# EAGLE design untitled (EAGLE 9.6.2)
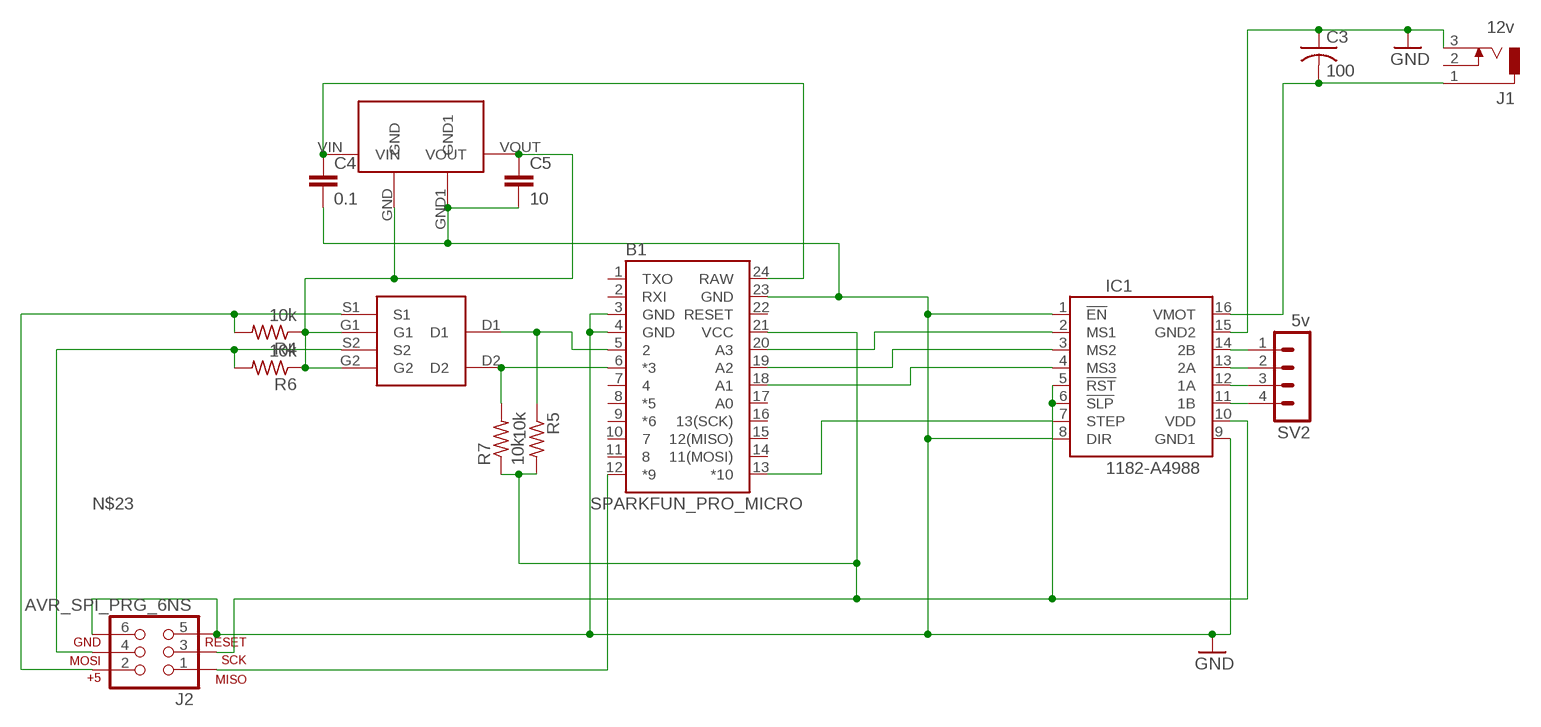
[diagram p0: schematic, sheet 1]

## Parts
B1  SPARKFUN_PRO_MICRO  [SPARKFUN_PRO_MICRO]
C3  100  C-US050-075X075  [C050-075X075]
C4  0.1  CAP0603-CAP  [0603-CAP]
C5  10  CAP0603-CAP  [0603-CAP]
IC1  1182-A4988  [A4988]
J1  12v  DCJ0303  [DCJ0303]
J2  AVR_SPI_PRG_6NS  [2X3-NS]
R4  10k  R-US_0207/10  [0207/10]
R5  10k  R-US_0207/10  [0207/10]
R6  10k  R-US_0207/10  [0207/10]
R7  10k  R-US_0207/10  [0207/10]
SV2  5v  MA04-1  [MA04-1]
U$2  LD1117  [SOT223]
U$3  BSS138  [SOT363]

## Nets
GND: B1.3(GND) B1.4(GND) B1.23(GND) C3.1 C4.2 C5.2 IC1.1(!EN) IC1.8(DIR) IC1.9(GND1) IC1.15(GND2) J1.3 J2.5 J2.6 U$2.GND1
N$1: IC1.14(2B) SV2.1
N$3: C5.1 R4.1 R6.1 U$2.GND U$2.VOUT U$3.G1 U$3.G2
N$4: IC1.13(2A) SV2.2
N$5: IC1.12(1A) SV2.3
N$6: IC1.11(1B) SV2.4
N$7: B1.20(A3) IC1.2(MS1)
N$8: B1.19(A2) IC1.3(MS2)
N$9: B1.18(A1) IC1.4(MS3)
N$10: B1.21(VCC) IC1.5(!RST) IC1.6(!SLP) IC1.10(VDD) J2.3 R5.2 R7.1
N$12: C3.2 IC1.16(VMOT) J1.1
N$13: B1.13(*10) IC1.7(STEP)
N$15: B1.24(RAW) C4.1 U$2.VIN
N$18: B1.12(*9) J2.1
N$19: B1.5 R5.1 U$3.D1
N$21: B1.6(*3) R7.2 U$3.D2
N$22: J2.2 R4.2 U$3.S1
N$23: J2.4 R6.2 U$3.S2
Unconnected: B1.1(TXO) B1.2(RXI) B1.7 B1.8(*5) B1.9(*6) B1.10 B1.11 B1.14(11(MOSI)) B1.15(12(MISO)) B1.16(13(SCK)) B1.17(A0) B1.22(RESET) J1.2

## Library data of the parts
B1 = SparkFun-Boards:SPARKFUN_PRO_MICRO: SparkFun Pro Micro Atmega32U4 compatible footprint. SparkFun Products: 3.3V/8MHz <https://www.sparkfun.com/products/12587> 5V/16MHz <https://www.sparkfun.com/products/12640>
C3 = rcl:C-US: CAPACITOR, American symbol; SPICEPREFIX: C
C4 C5 = SparkFun:CAP: Capacitor Standard 0603 ceramic capacitor, and 0.1" leaded capacitor.
IC1 = pololu-stepper-driver:1182-A4988: A4988 Stepper Motor Driver Carrier #1182 A4988 Stepper Motor Driver Carrier <https://www.pololu.com/product/1182> in Japan, Suzaku Lab. Ltd. <https://suzakugiken.jp/> #1182 A4988ステッピングモータドライバ <https://szc.jp/po1182>
J1 = con-jack:DCJ0303: DC POWER JACK Source: DCJ0303.pdf; OC_FARNELL: unknown; OC_NEWARK: unknown
J2 = SparkFun:AVR_SPI_PRG_6: AVR ISP 6 Pin This is the reduced ISP connector for AVR programming. Common on Arduino. This footprint will take up less PCB space and can be used with a 10-pin to 6-pin adapter such as SKU: BOB-08508
R4-R7 = rcl:R-US_: RESISTOR, American symbol; SPICEPREFIX: R
SV2 = con-lstb:MA04-1: PIN HEADER; OC_FARNELL: unknown; OC_NEWARK: unknown
U$2 = LD1117:LD1117
U$3 = BSS138:BSS138

## Board
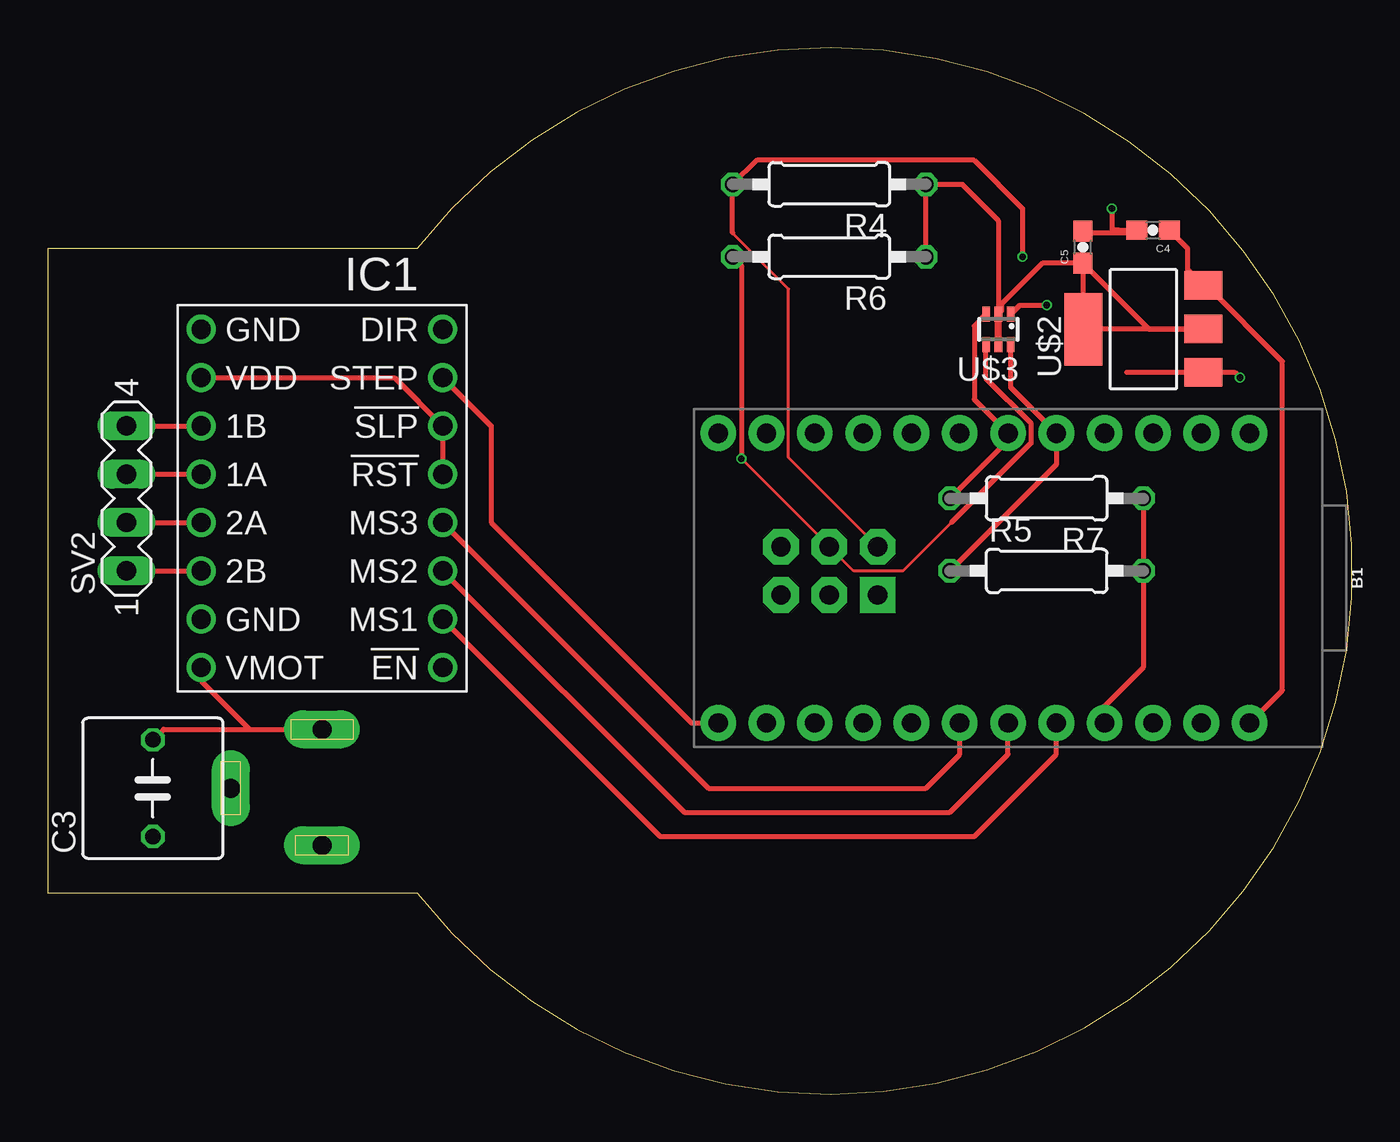
[diagram p1: board, top side]
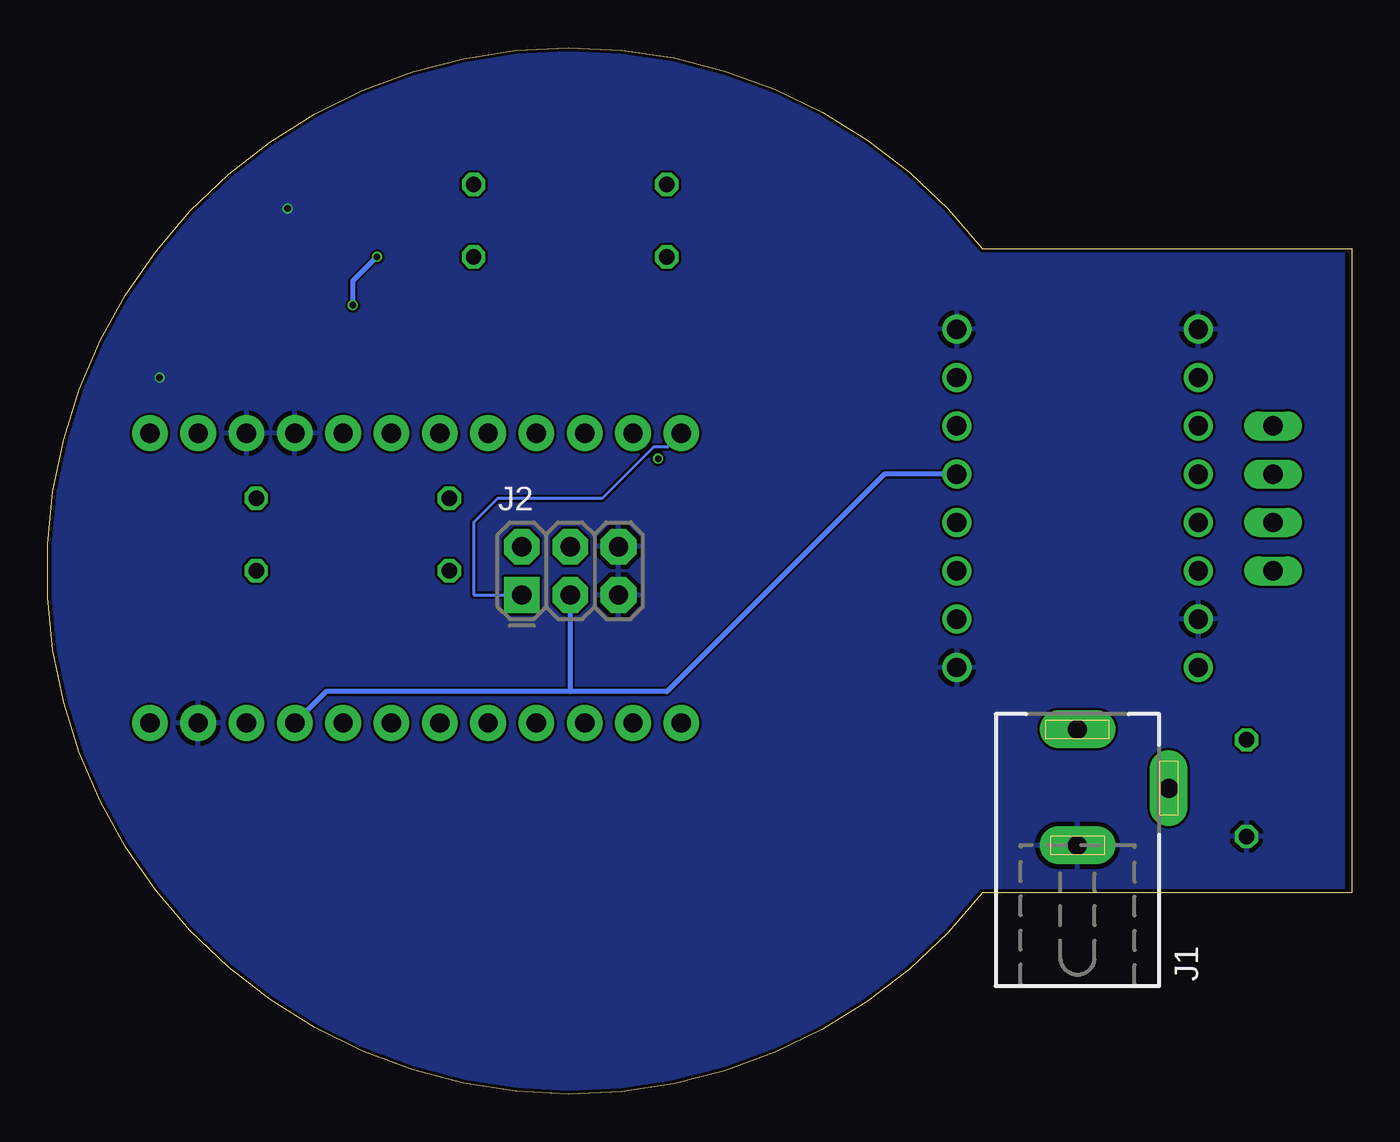
[diagram p2: board, bottom side, seen from below]

Size 68.58 x 55.03 mm. Coordinates in mm from the lower left corner, seen from the top.
Outline: 0,10.58 19.42,10.58 arc284 19.42,44.45 0,44.45 0,10.58
Copper layers (1*16): Top 0.035559375mm / dielectric 1.6mm / Bottom 0.035559375mm
Design rules "jlcpcb2layer": minimum track width 5mil, minimum drill 12mil, track to track 5mil, track to pad 5mil, pad to pad 5mil, via to via 5mil, smd to smd 5mil, copper to edge 8mil, drill to drill 6mil, minimum pad ring 5mil, minimum via ring 3mil, stop-mask expansion 2.5mil, vias tented up to drill 0mil, thermal gap 10mil

### Footprints (pad centres in the part's own frame; a part is rotated, then mirrored left to right if it is on the bottom)
SPARKFUN_PRO_MICRO = drill 1.016 pad 1.88: 1 -7.62,12.7; 2 -7.62,10.16; 3 -7.62,7.62; 4 -7.62,5.08; 5 -7.62,2.54; 6 -7.62,0; 7 -7.62,-2.54; 8 -7.62,-5.08; 9 -7.62,-7.62; 10 -7.62,-10.16; 11 -7.62,-12.7; 12 -7.62,-15.24; 13 7.62,-15.24; 14 7.62,-12.7; 15 7.62,-10.16; 16 7.62,-7.62; 17 7.62,-5.08; 18 7.62,-2.54; 19 7.62,0; 20 7.62,2.54; 21 7.62,5.08; 22 7.62,7.62; 23 7.62,10.16; 24 7.62,12.7
C050-075X075 = drill 0.813 octagon: 1 -2.54,0; 2 2.54,0
0603-CAP = smd 1.1 x 1: 1 -0.85,0; 2 0.85,0
A4988 = drill 1.016: 1 -6.35,8.89; 2 -6.35,6.35; 3 -6.35,3.81; 4 -6.35,1.27; 5 -6.35,-1.27; 6 -6.35,-3.81; 7 -6.35,-6.35; 8 -6.35,-8.89; 9 6.35,-8.89; 10 6.35,-6.35; 11 6.35,-3.81; 12 6.35,-1.27; 13 6.35,1.27; 14 6.35,3.81; 15 6.35,6.35; 16 6.35,8.89
DCJ0303 = drill 1 pad 2 long: 1 0,3.1; 2 4.8,0; 3 0,-3
2X3-NS = drill 1.016 pad 1.88 square: 1 -2.54,-1.27 | drill 1.016 pad 1.88 octagon: 2 -2.54,1.27; 3 0,-1.27; 4 0,1.27; 5 2.54,-1.27; 6 2.54,1.27
0207/10 = drill 0.813 octagon: 1 -5.08,0; 2 5.08,0
MA04-1 = drill 1.016 long: 1 -3.81,0; 2 -1.27,0; 3 1.27,0; 4 3.81,0
SOT223 = smd 3.81 x 2.007: GND 0,3.15 | smd 1.499 x 2.007: GND1 -2.261,-3.15; VIN 2.311,-3.15; VOUT 0.025,-3.15
SOT363 = smd 0.4 x 0.8: D1 -0.65,0.8; D2 0.65,-0.8; G1 0,-0.8; G2 0,0.8; S1 -0.65,-0.8; S2 0.65,0.8

### Placement (x,y rotation side)
B1  50.5,27.13 270 top
C3  5.54,16.08 90 top
C4  58.12,45.42 180 top
C5  54.44,44.53 90 top
IC1  14.43,31.32 180 top
J1  14.43,16.08 0 bottom
J2  41.1,27.51 0 bottom
R4  41.1,47.83 180 top
R5  52.53,27.51 0 top
R6  41.1,44.02 180 top
R7  52.53,31.32 180 top
SV2  4.14,31.32 90 top
U$2  57.61,40.21 90 top
U$3  49.99,40.21 180 top

### Tracks (layer width: path | path; a pad name or v marks a point on that pad's centre or on a via)
GND  (via drill 0.35)
  Top 0.254: v62.69,37.67 62.41,37.95 U$2.GND1 56.72,37.95 | 56.34,45.42 55.96,45.42 v55.96,46.56 | 56.34,45.29 54.74,45.29 C5.2 | 56.34,45.42 56.34,45.29 | 56.34,45.42 C4.2 57.14,45.29 56.34,45.29
  pour Bottom: 0.46,56.72 0.46,-1.7 53.8,-1.7 70.31,14.81 70.31,38.94 52.53,56.72
N$1
  Top 0.254: SV2.1 IC1.14
N$3
  Top 0.152: 60.79,40.21 U$2.VOUT
  Top 0.254: C5.1 57.9,40.21 60.79,40.21 | C5.1 52.31,43.68 50.16,41.53 50.16,41.18 U$3.G1 49.99,45.93 48.09,47.83 R4.1 R6.1 | U$2.VOUT 60.73,40.21 U$2.GND 54.46,43.66 C5.1
  Top 0.381: U$3.G2 U$3.G1
N$4
  Top 0.254: SV2.2 IC1.13
N$5
  Top 0.254: SV2.3 IC1.12
N$6
  Top 0.254: SV2.4 IC1.11
N$7
  Top 0.254: IC1.2 32.21,13.54 48.72,13.54 53.04,17.86 B1.20
N$8
  Top 0.254: IC1.3 33.48,14.81 47.45,14.81 50.5,17.86 B1.19
N$9
  Top 0.254: IC1.4 34.75,16.08 46.18,16.08 47.96,17.86 B1.18
N$10
  Top 0.254: IC1.5 IC1.6 18.24,37.67 IC1.10 | B1.21 55.13,19.96 57.61,22.43 R5.2 R7.1
  Bottom 0.254: IC1.5 24.59,32.59 36.02,21.16 41.1,21.16 | B1.21 53.93,21.16 41.1,21.16 | J2.3 41.1,21.16
N$12
  Top 0.254: C3.2 6.1,19.18 10.62,19.18 | 10.62,19.18 J1.1 | IC1.16 8.08,21.72 10.62,19.18
N$13
  Top 0.254: IC1.7 23.32,35.13 23.32,30.05 33.86,19.51 B1.13
N$15
  Top 0.152: 60.91,42.52 U$2.VIN
  Top 0.254: C4.1 59.94,44.45 59.94,43.34 U$2.VIN | B1.24 64.92,21.23 64.92,38.52 60.91,42.52
N$18
  Bottom 0.152: B1.12 36,34.01 36.73,34.01 39.42,31.32 44.91,31.32 46.18,30.05 46.18,26.24 J2.1
N$19
  Top 0.254: U$3.D1 50.64,37.15 B1.5 53.04,33.1 R5.1
N$21
  Top 0.254: U$3.D2 48.72,40.39 48.72,36.53 B1.6 50.5,34.37 R7.2
N$22  (via drill 0.35)
  Top 0.152: J2.2 38.97,33.46 38.97,42.33 37.28,44.02 36.02,45.28
  Top 0.254: v51.26,44.02 51.26,46.56 48.72,49.1 37.29,49.1 R4.2 36.02,45.28 | U$3.S1 51.11,41.48 v52.53,41.48
  Bottom 0.254: v51.26,44.02 52.53,42.75 v52.53,41.48
N$23  (via drill 0.35)
  Top 0.152: 47.52,30.05 44.98,27.51 42.37,27.51 J2.4 v36.48,33.41
  Top 0.254: v36.48,33.41 36.48,43.57 R6.2 | U$3.S2 49.34,37.63 51.72,35.26 51.72,34.25 47.52,30.05